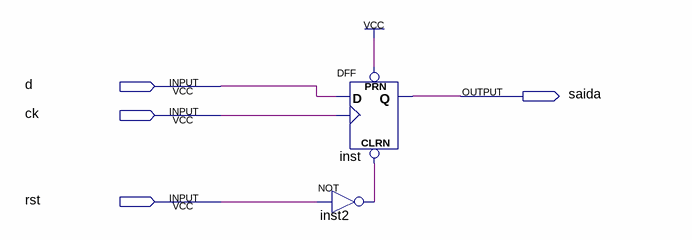
[diagram p0: schematic sheet]
// Quartus schematic Pratica05_DFF_1_bit.bdf as structural Verilog: 2 symbols, 4 pins
module Pratica05_DFF_1_bit (
  input  d,
  input  ck,
  input  rst,
  output saida
);

  wire inst2_out;

  DFF inst (.CLRN(inst2_out), .CLK(ck), .D(d), .PRN(1'b1), .Q(saida));
  not inst2 (inst2_out, rst);
endmodule
